# Altium schematic sheet PWM Drivers.SchDoc
size A4; SheetNumber: 10; SheetTotal: 12
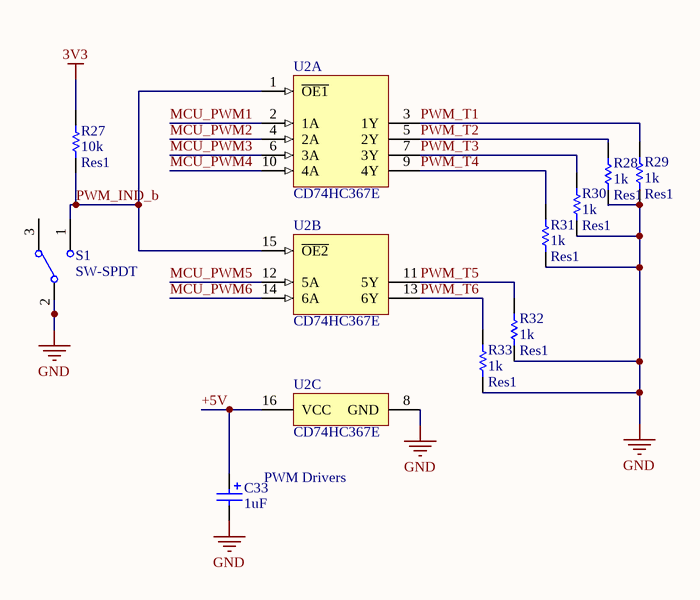
[diagram p0: PWM Drivers.SchDoc]

## Parts
C33  value 1uF  [RAD-0.1]  (hidden comment: Cap No Pol)
R27  Res1  value 10k  [AXIAL-0.4]
R28  Res1  value 1k  [AXIAL-0.4]
R29  Res1  value 1k  [AXIAL-0.4]
R30  Res1  value 1k  [AXIAL-0.4]
R31  Res1  value 1k  [AXIAL-0.4]
R32  Res1  value 1k  [AXIAL-0.4]
R33  Res1  value 1k  [AXIAL-0.4]
S1  SW-SPDT  [MHDR1X3]
U2  CD74HC367E  [N0016A]  (parts A,B,C of 3)

## Nets
3V3: R27.2
GND: C33.2 R28.1 R29.1 R30.1 R31.1 R32.1 R33.1 S1.2 U2.8(GND)
+5V: C33.1 U2.16(VCC)
MCU_PWM1: U2.2(1A)
MCU_PWM2: U2.4(2A)
MCU_PWM3: U2.6(3A)
MCU_PWM4: U2.10(4A)
MCU_PWM5: U2.12(5A)
MCU_PWM6: U2.14(6A)
PWM_IND_b: R27.1 S1.1 U2.1(~{OE1}) U2.15(~{OE2})
PWM_T1: R29.2 U2.3(1Y)
PWM_T2: R28.2 U2.5(2Y)
PWM_T3: R30.2 U2.7(3Y)
PWM_T4: R31.2 U2.9(4Y)
PWM_T5: R32.2 U2.11(5Y)
PWM_T6: R33.2 U2.13(6Y)

Not connected (* = marked no-connect by the designer): S1 3

## Notes on the sheet
- (near C33) PWM Drivers

## Library data of the parts
C33 = Cap No Pol: Polarized Capacitor (Radial); Published: 8-Jun-2000; LatestRevisionDate: 17-Jul-2002; LatestRevisionNote: Re-released for DXP Platform.; PackageReference: RB7.6-15; Publisher: Altium Limited; PackageDescription: Polarized Capacitor (Radial); 2 Leads
R27-R33 = Res1: Resistor; Published: 8-Jun-2000; LatestRevisionDate: 17-Jul-2002; LatestRevisionNote: Re-released for DXP Platform.; PackageReference: AXIAL-0.3; Publisher: Altium Limited; PackageDescription: Axial Device, Thru-Hole; 2 Leads; 0.3 in Pin Spacing
S1 = SW-SPDT: SPDT Subminiature Toggle Switch, Right Angle Mounting, Vertical Actuation; Published: 24-Mar-1999; LatestRevisionDate: 17-Dec-2003; LatestRevisionNote: Schematic revised, PCB Footprint replaced.; DatasheetVersion: 05-Dec-2000; PackageReference: TL36WW15050; Publisher: Altium Limited; PackageDescription: Switch; 4 Leads; ComponentLink1Description: Manufacturer Link; ComponentLink1URL: http://www.apem.com
U2 = CMP-0440-00947-3: High Speed CMOS Logic Hex Buffers/Line Drivers with Non-Inverting 3-State Outputs, N0016A, TUBE; Manufacturer: Texas Instruments; Voltage(Nom)(V): 6; VCC(Min)(V): 2; F @ Nom Voltage(Max)(Mhz): 28; ICC @ Nom Voltage(Max)(mA): 0.08; tpd @ Nom Voltage(Max)(ns): 24; Rating: Catalog; Operating Temperature Range(C): -55 to 125; Output Type: CMOS; DatasheetVersion: SCHS181D; Code_JEDEC: MS-001; PackageReference: N0016A; PackageVersion: http://www.ti.com/lit/ml/mpdi002c/mpdi002c.pdf; Generic Part Number: CD74HC367; Bits(#): 6; VCC(Max)(V): 6; Input Type: CMOS